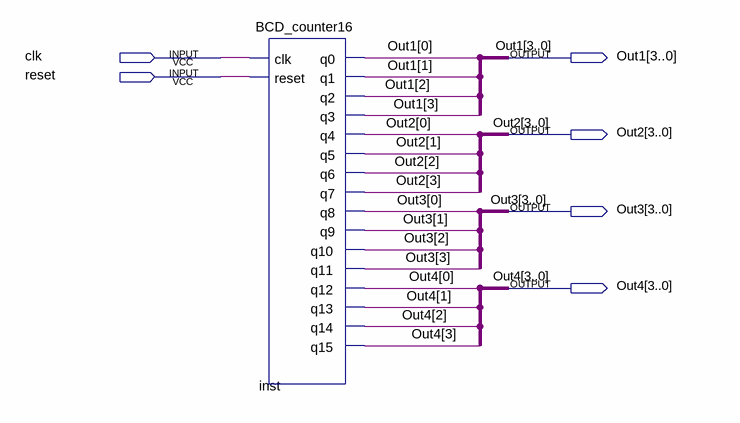
[diagram p0: schematic sheet]
// Quartus schematic BCD_counter_Bus.bdf as structural Verilog: 1 symbols, 6 pins
module BCD_counter_Bus (
  input  clk,
  input  reset,
  output [3:0] Out1,
  output [3:0] Out2,
  output [3:0] Out3,
  output [3:0] Out4
);

  BCD_counter16 inst (
    .clk(clk), .reset(reset), .q0(Out1[0]), .q1(Out1[1]), .q2(Out1[2]), .q3(Out1[3]), .q4(Out2[0]),
    .q5(Out2[1]), .q6(Out2[2]), .q7(Out2[3]), .q8(Out3[0]), .q9(Out3[1]), .q10(Out3[2]), .q11(Out3[3]),
    .q12(Out4[0]), .q13(Out4[1]), .q14(Out4[2]), .q15(Out4[3]));
endmodule
